# EasyEDA schematic SCH_weatherstation_2024-12-12.json
TITLE: Sheet_1; REV: 1.0; Date: 2024-04-07; Sheet: 1/1; Drawn By: aminm; Company: Your Company
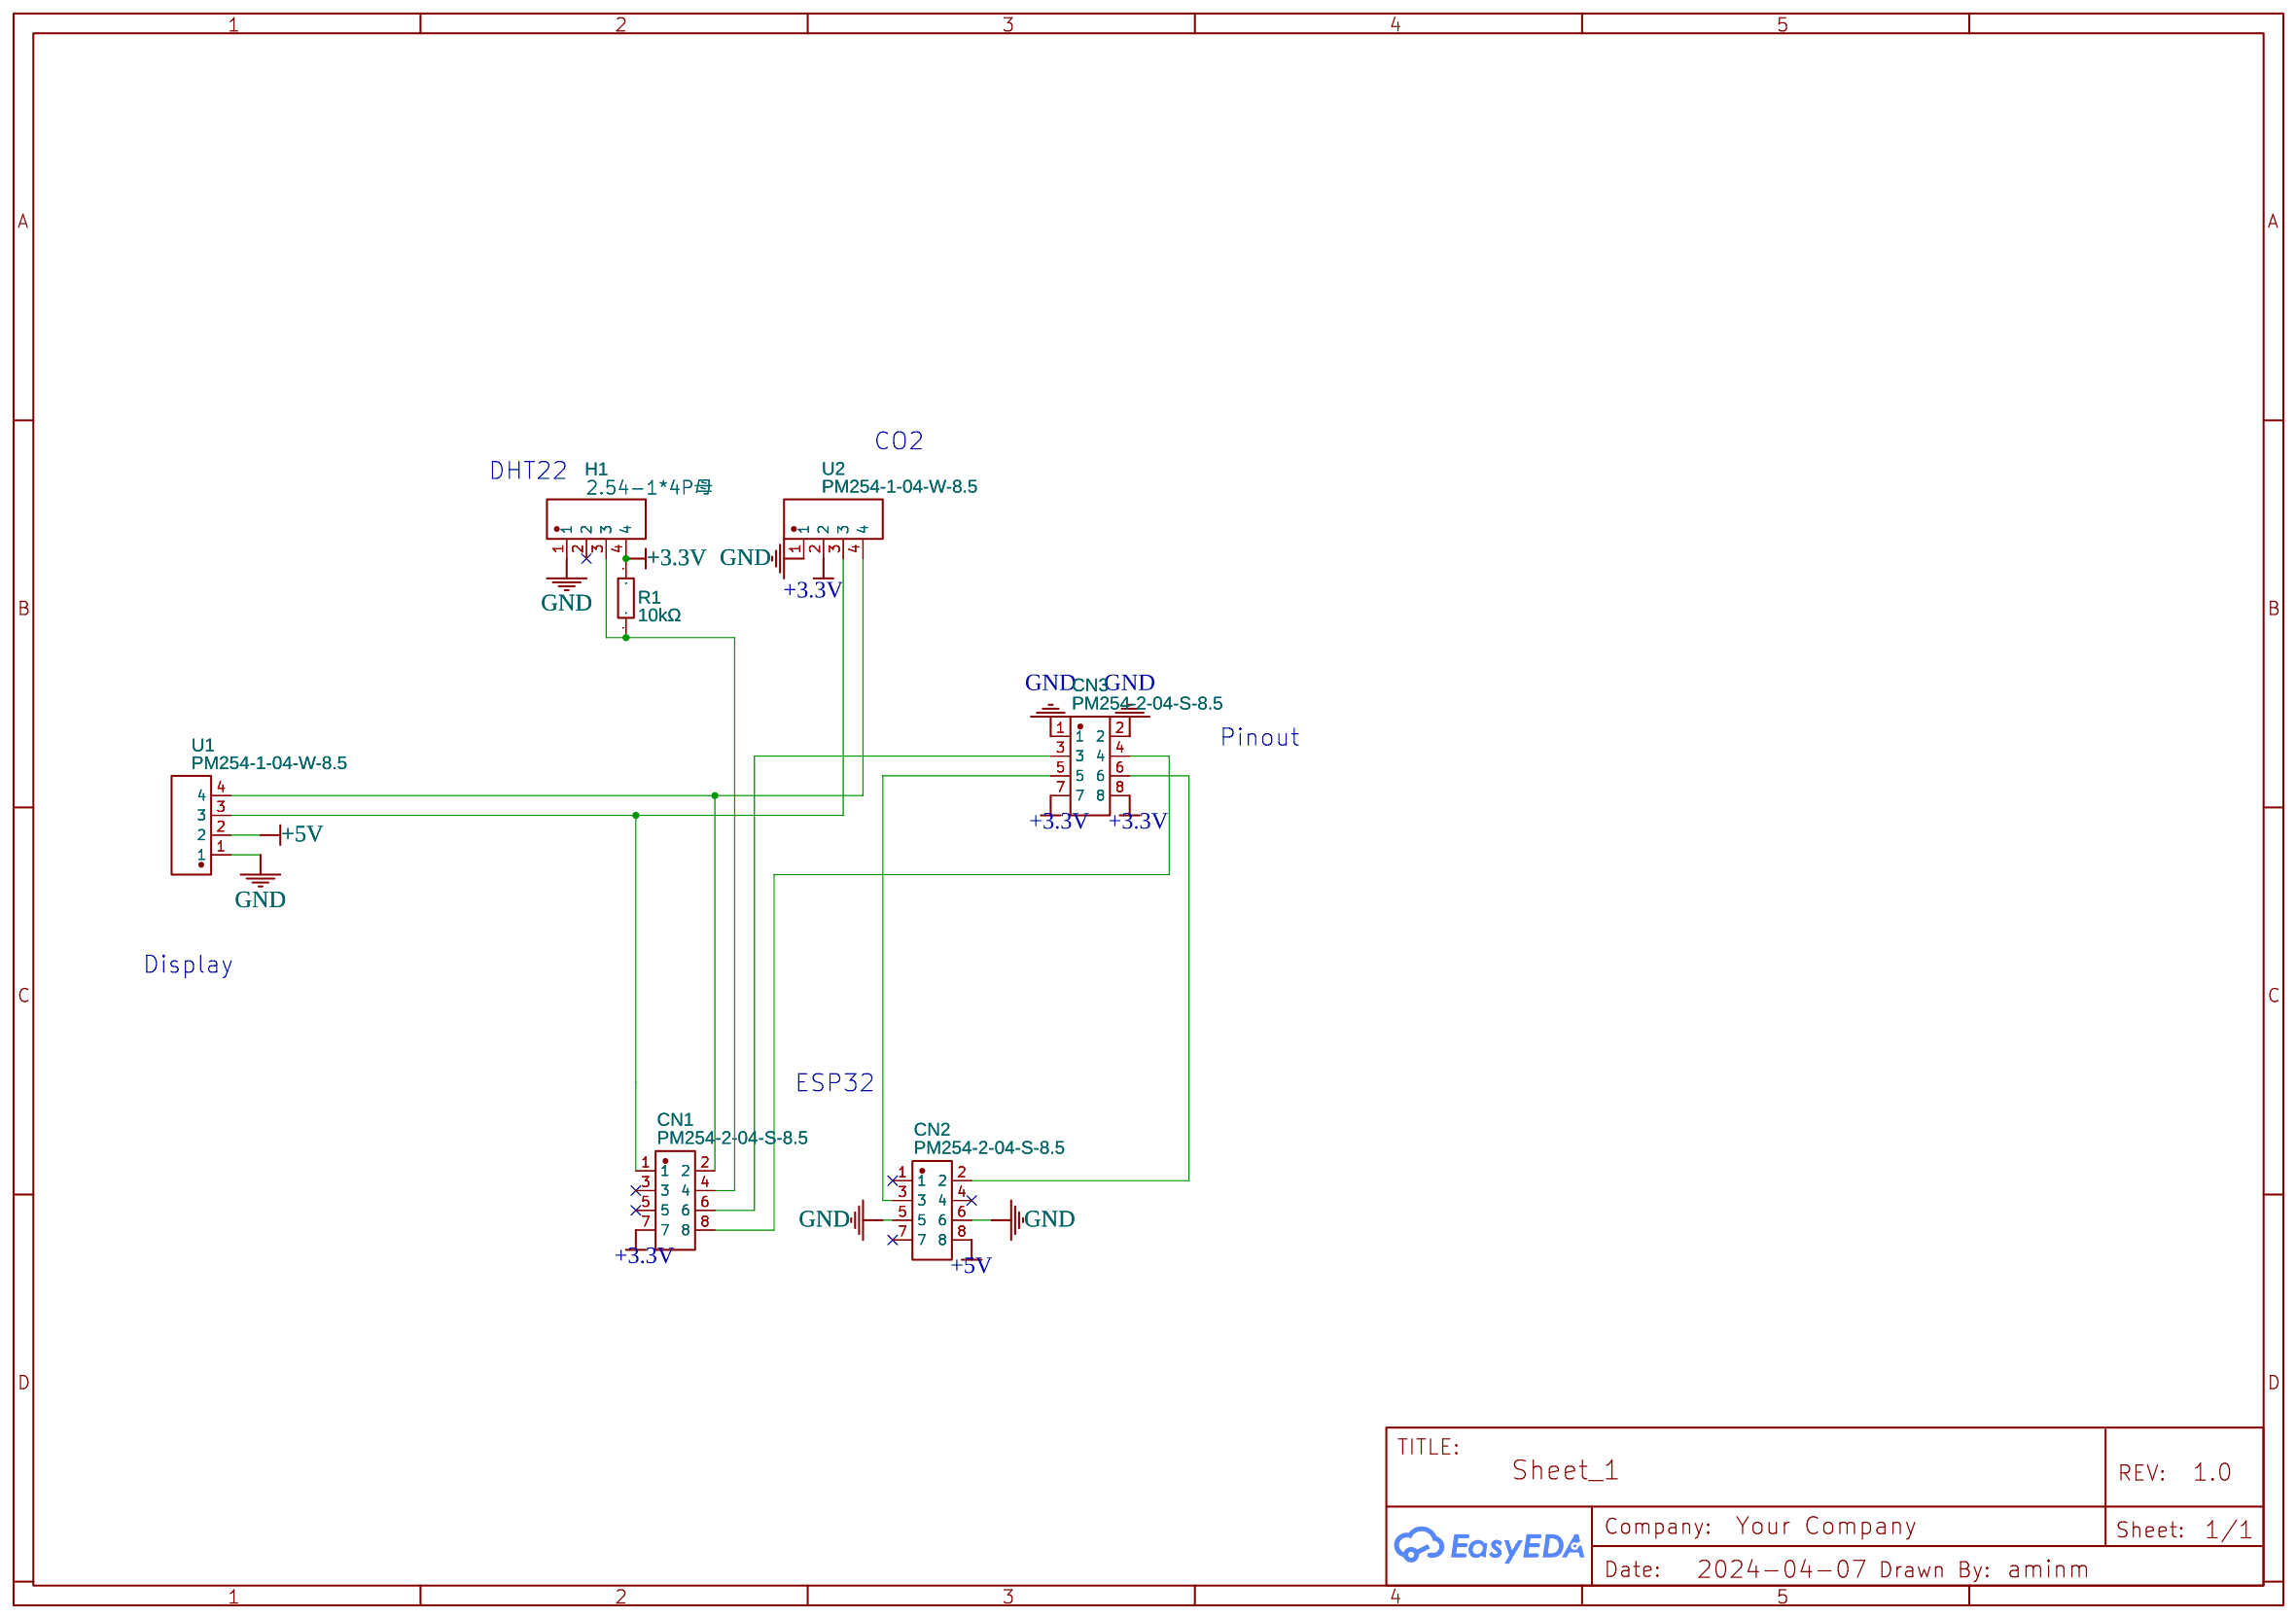
[diagram p0: schematic sheet]

## Parts
CN1  PM254-2-04-S-8.5  [HDR-SMD_8P-P2.54-V-F-R2-C4-S7.1]
CN2  PM254-2-04-S-8.5  [HDR-SMD_8P-P2.54-V-F-R2-C4-S7.1]
CN3  PM254-2-04-S-8.5  [HDR-SMD_8P-P2.54-V-F-R2-C4-S7.1]
H1  2.54-1*4P母  [HDR-TH_4P-P2.54-V-F]
R1  10kΩ  [R0603]
U1  PM254-1-04-W-8.5  [HDR-TH_4P-P2.54-H-F-W10.0-N]
U2  PM254-1-04-W-8.5  [HDR-TH_4P-P2.54-H-F-W10.0-N]

## Library data of the parts
CN1-CN3 = PM254-2-04-S-8.5: Contributor: lcsc; Supplier: LCSC; Supplier Part: C3975149; Manufacturer: HCTL(华灿天禄); JLCPCB Part Class: Extended Part
H1 = 2.54-1*4P母: Contributor: LCSC; Supplier: LCSC; Supplier Part: C2718488; Manufacturer: BOOMELE(博穆精密); JLCPCB Part Class: Extended Part
R1 = 0603WAF1002T5E: Supplier: LCSC; Manufacturer: UNI-ROYAL(厚声); Supplier Part: C25804; JLCPCB Part Class: Basic Part
U1 U2 = PM254-1-04-W-8.5: Contributor: LCSC; Supplier: LCSC; Supplier Part: C2897386; Manufacturer: HCTL(华灿天禄); JLCPCB Part Class: Extended Part

## Nets
+3.3V: CN1.7 CN3.7 CN3.8 H1.4 R1.2 U2.2
+5V: CN2.8 U1.2
GND: CN2.5 CN2.6 CN3.1 CN3.2 H1.1 U1.1 U2.1
Net-(CN1-1): CN1.1 U1.3 U2.3
Net-(CN1-2): CN1.2 U1.4 U2.4
Net-(CN1-4): CN1.4 H1.3 R1.1
Net-(CN1-6): CN1.6 CN3.3
Net-(CN1-8): CN1.8 CN3.4
Net-(CN2-2): CN2.2 CN3.6
Net-(CN2-3): CN2.3 CN3.5

Not connected (* = marked no-connect by the designer): CN1 3* 5*; CN2 1* 4* 7*; H1 2*

## Notes on the sheet
- CO2
- DHT22
- Pinout
- Display
- ESP32
